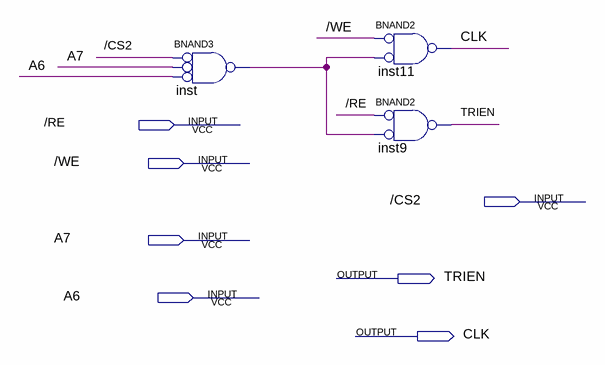
[diagram p0: schematic sheet]
// Quartus schematic lab_4.bdf as structural Verilog: 3 symbols, 7 pins
module lab_4 (
  input  \/RE ,
  input  \/WE ,
  input  \/CS2 ,
  input  A7,
  input  A6,
  output TRIEN,
  output CLK
);

  wire inst_out;

  nand inst (inst_out, ~\/CS2 , ~A7, ~A6);  // BNAND3
  nand inst11 (CLK, ~\/WE , ~inst_out);  // BNAND2
  nand inst9 (TRIEN, ~\/RE , ~inst_out);  // BNAND2
endmodule
